# EAGLE schematic Gimbal-Motor-PowerBoard (EAGLE 8.3.1)
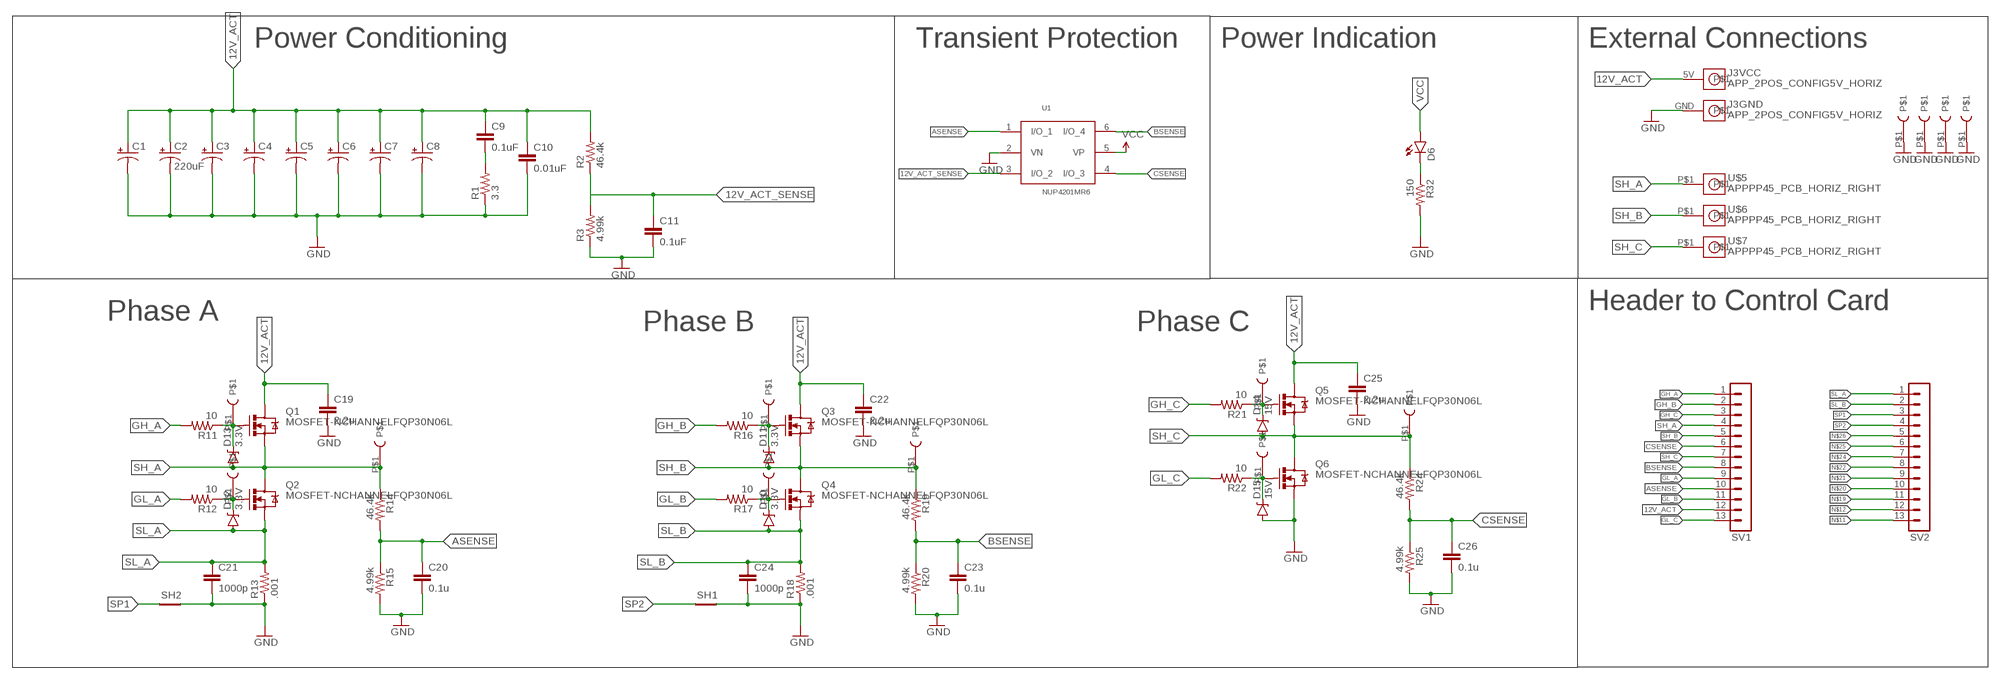
[diagram p0: schematic, sheet 1]

## Parts
C1  CAP_POLPTH4  [CPOL-RADIAL-1000UF-25V]
C2  220uF  CAP_POLPTH4  [CPOL-RADIAL-1000UF-25V]
C3  CAP_POLPTH4  [CPOL-RADIAL-1000UF-25V]
C4  CAP_POLPTH4  [CPOL-RADIAL-1000UF-25V]
C5  CAP_POLPTH4  [CPOL-RADIAL-1000UF-25V]
C6  CAP_POLPTH4  [CPOL-RADIAL-1000UF-25V]
C7  CAP_POLPTH4  [CPOL-RADIAL-1000UF-25V]
C8  CAP_POLPTH4  [CPOL-RADIAL-1000UF-25V]
C9  0.1uF  CAP0805  [0805]
C10  0.01uF  CAP0805  [0805]
C11  0.1uF  CAP0805  [0805]
C19  2.2u  CAP1206  [1206]
C20  0.1u  CAP0805  [0805]
C21  1000p  CAP0805  [0805]
C22  2.2u  CAP1206  [1206]
C23  0.1u  CAP0805  [0805]
C24  1000p  CAP0805  [0805]
C25  2.2u  CAP1206  [1206]
C26  0.1u  CAP0805  [0805]
D6  LED1206  [LED-1206]
D10  3.3V  DIODE-ZENER3.3V  [SOD-323]
D11  3.3V  DIODE-ZENER3.3V  [SOD-323]
D12  3.3V  DIODE-ZENER3.3V  [SOD-323]
D13  3.3V  DIODE-ZENER3.3V  [SOD-323]
D14  15V  DIODE-ZENER3.3V  [SOD-323]
D15  15V  DIODE-ZENER3.3V  [SOD-323]
J3  APP_2POS_CONFIG5V_HORIZ  [APP45_5V_HORIZ_CONFIG]
Q1  MOSFET-NCHANNELFQP30N06L  [TO220V]
Q2  MOSFET-NCHANNELFQP30N06L  [TO220V]
Q3  MOSFET-NCHANNELFQP30N06L  [TO220V]
Q4  MOSFET-NCHANNELFQP30N06L  [TO220V]
Q5  MOSFET-NCHANNELFQP30N06L  [TO220V]
Q6  MOSFET-NCHANNELFQP30N06L  [TO220V]
R1  3.3  RESISTOR1206  [1206]
R2  46.4k  RESISTOR0805-RES  [0805]
R3  4.99k  RESISTOR0805-RES  [0805]
R11  10  RESISTOR0805-RES  [0805]
R12  10  RESISTOR0805-RES  [0805]
R13  .001  RESISTOR1206  [1206]
R14  46.4k  RESISTOR0805-RES  [0805]
R15  4.99k  RESISTOR0805-RES  [0805]
R16  10  RESISTOR0805-RES  [0805]
R17  10  RESISTOR0805-RES  [0805]
R18  .001  RESISTOR1206  [1206]
R19  46.4k  RESISTOR0805-RES  [0805]
R20  4.99k  RESISTOR0805-RES  [0805]
R21  10  RESISTOR0805-RES  [0805]
R22  10  RESISTOR0805-RES  [0805]
R24  46.4k  RESISTOR0805-RES  [0805]
R25  4.99k  RESISTOR0805-RES  [0805]
R32  150  RESISTOR0805-RES  [0805]
SH1  SHORT-HT5  [SHORT_TOP-50]
SH2  SHORT-HT5  [SHORT_TOP-50]
SV1  MA13-1  [MA13-1]
SV2  MA13-1  [MA13-1]
U1  NUP4201MR6  [TSOP-6]
U$5  APPPP45_PCB_HORIZ_RIGHT  [APP45_PCB_HORIZ_RIGHT]
U$6  APPPP45_PCB_HORIZ_RIGHT  [APP45_PCB_HORIZ_RIGHT]
U$7  APPPP45_PCB_HORIZ_RIGHT  [APP45_PCB_HORIZ_RIGHT]
U$12  TEST_POINT_0.1INDIAM  [TEST_POINT_0.1INDIAM]
U$15  TEST_POINT_0.1INDIAM  [TEST_POINT_0.1INDIAM]
U$16  TEST_POINT_0.1INDIAM  [TEST_POINT_0.1INDIAM]
U$17  TEST_POINT_0.1INDIAM  [TEST_POINT_0.1INDIAM]
U$18  TEST_POINT_0.1INDIAM  [TEST_POINT_0.1INDIAM]
U$19  TEST_POINT_0.1INDIAM  [TEST_POINT_0.1INDIAM]
U$20  TEST_POINT_0.1INDIAM  [TEST_POINT_0.1INDIAM]
U$24  TEST_POINT_0.1INDIAM  [TEST_POINT_0.1INDIAM]
U$25  TEST_POINT_0.1INDIAM  [TEST_POINT_0.1INDIAM]
U$26  TEST_POINT_0.1INDIAM  [TEST_POINT_0.1INDIAM]
U$27  TEST_POINT_0.1INDIAM  [TEST_POINT_0.1INDIAM]
U$28  TEST_POINT_0.1INDIAM  [TEST_POINT_0.1INDIAM]
U$29  TEST_POINT_0.1INDIAM  [TEST_POINT_0.1INDIAM]

## Nets
12V_ACT: C1.1(+) C2.1(+) C3.1(+) C4.1(+) C5.1(+) C6.1(+) C7.1(+) C8.1(+) C9.1 C10.1 C19.1 C22.1 C25.1 J3.5V Q1.2(D) Q3.2(D) Q5.2(D) R2.2 SV1.12
12V_ACT_SENSE: C11.1 R2.1 R3.2 U1.3(I/O_2)
ASENSE: C20.1 R14.2 R15.1 SV1.10 U1.1(I/O_1)
BSENSE: C23.1 R19.2 R20.1 SV1.8 U1.6(I/O_4)
CSENSE: C26.1 R24.2 R25.1 SV1.6 U1.4(I/O_3)
GH_A: R11.2 SV1.1
GH_B: R16.2 SV1.2
GH_C: R21.2 SV1.3
GL_A: R12.2 SV1.9
GL_B: R17.2 SV1.11
GL_C: R22.2 SV1.13
GND: C1.2(-) C2.2(-) C3.2(-) C4.2(-) C5.2(-) C6.2(-) C7.2(-) C8.2(-) C10.2 C11.2 C19.2 C20.2 C21.2 C22.2 C23.2 C24.2 C25.2 C26.2 D15.A J3.GND Q6.3(S) R1.1 R3.1 R13.1 R15.2 R18.1 R20.2 R25.2 R32.2 SH1.2 SH2.2 U1.2(VN) U$26.P$1 U$27.P$1 U$28.P$1 U$29.P$1
N$1: C9.2 R1.2
N$11: SV2.13
N$12: SV2.12
N$13: D13.C Q1.1(G) R11.1 U$12.P$1
N$14: D11.C Q3.1(G) R16.1 U$16.P$1
N$15: D10.C Q4.1(G) R17.1 U$17.P$1
N$16: D12.C Q2.1(G) R12.1 U$15.P$1
N$17: D14.C Q5.1(G) R21.1 U$18.P$1
N$18: D15.C Q6.1(G) R22.1 U$19.P$1
N$19: SV2.11
N$20: SV2.10
N$21: SV2.9
N$22: SV2.8
N$23: D6.C R32.1
N$24: SV2.7
N$25: SV2.6
N$26: SV2.5
SH_A: D13.A Q1.3(S) Q2.2(D) R14.1 SV1.4 U$5.P$1 U$25.P$1
SH_B: D11.A Q3.3(S) Q4.2(D) R19.1 SV1.5 U$6.P$1 U$24.P$1
SH_C: D14.A Q5.3(S) Q6.2(D) R24.1 SV1.7 U$7.P$1 U$20.P$1
SL_A: C21.1 D12.A Q2.3(S) R13.2 SV2.1
SL_B: C24.1 D10.A Q4.3(S) R18.2 SV2.2
SP1: SH2.1 SV2.3
SP2: SH1.1 SV2.4
VCC: D6.A U1.5(VP)

## Notes on the sheet
- Power Conditioning | Transient Protection | Power Indication | External Connections
- Header to Control Card
- Phase A
- Phase B | Phase C

## Library data of the parts
C1-C8 = SparkFun-Passives:CAP_POL: Capacitor Polarized These are standard SMD and PTH capacitors. Normally 10uF, 47uF, and 100uF in electrolytic and tantalum varieties. Always verify the external diameter of the through hole cap, it varies with capacity, voltage, and manufacturer. The EIA devices should be standard.
C9-C11 C19-C26 = SparkFun-Passives:CAP: Capacitor Standard 0603 ceramic capacitor, and 0.1" leaded capacitor.
D6 = SparkFun-LED:LED: LEDs Standard schematic elements and footprints for 5mm, 3mm, 1206, and 0603 sized LEDs. 5mm - Spark Fun Electronics SKU : COM-00529 (and others)
D10-D13 = SparkFun-DiscreteSemi:DIODE-ZENER: Zener Diode Production Part - 8199 3.4V Zener Voltage; PROD_ID: DIO-11284
D14 D15 = SparkFun-DiscreteSemi:DIODE-ZENER: Zener Diode Production Part - 8199 3.4V Zener Voltage; PROD_ID: DIO-11284; VALUE: 3.3V
J3 = MRDT-Connectors:APP_2POS_CONFIG; COLOR1: RED; COLOR2: BLACK
Q1-Q6 = SparkFun-DiscreteSemi:MOSFET-NCHANNEL: Common NMOSFET Parts MFG P/N Store ID Prod ID FDD8780 TRANS-09984 SI7820DN TRANS-11055 FDS6630A IC-08089 2N7002PW TRANS-11151 FQP30N06L COM-10213 TRANS-10060 BSS123LT1G TRANS-08345 BSS138 TRANS-00830 BS170 2N7000; PROD_ID: TRANS-10060
R1-R3 R11-R22 R24 R25 R32 = SparkFun-Passives:RESISTOR: Resistor Basic schematic elements and footprints for 0603, 1206, and PTH resistors.
SH1 SH2 = BLDC_Motor_Controller_2016_Rev1:SHORT-H: Short between two nets; BOM: no
SV1 SV2 = con-lstb:MA13-1: PIN HEADER; OC_FARNELL: unknown; OC_NEWARK: unknown
U1 = MRDT-ICs:NUP4201MR6
U$5-U$7 = MRDT-Connectors:APP: http://www.powerwerx.com/anderson-powerpoles/
U$12 U$15-U$20 U$24-U$29 = MRDT-Connectors:TEST_POINT_0.1INDIAM